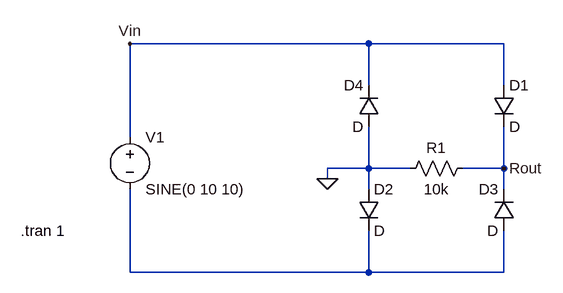
[diagram p0: schematic Bridge Rectifier.asc]
Bridge Rectifier.asc, the LTspice schematic file:
Version 4
SHEET 1 896 680
WIRE 400 -16 32 -16
WIRE 608 -16 400 -16
WIRE 400 48 400 -16
WIRE 608 48 608 -16
WIRE 32 128 32 -16
WIRE 400 176 400 112
WIRE 400 176 336 176
WIRE 464 176 400 176
WIRE 608 176 608 112
WIRE 608 176 544 176
WIRE 336 192 336 176
WIRE 400 208 400 176
WIRE 608 208 608 176
WIRE 32 336 32 208
WIRE 400 336 400 272
WIRE 400 336 32 336
WIRE 608 336 608 272
WIRE 608 336 400 336
FLAG 32 -16 Vin
FLAG 608 176 Rout
FLAG 336 192 0
SYMBOL diode 592 48 R0
SYMATTR InstName D1
SYMBOL diode 384 208 R0
SYMATTR InstName D2
SYMBOL diode 624 272 R180
WINDOW 0 24 64 Left 2
WINDOW 3 24 0 Left 2
SYMATTR InstName D3
SYMBOL diode 416 112 R180
WINDOW 0 24 64 Left 2
WINDOW 3 24 0 Left 2
SYMATTR InstName D4
SYMBOL res 560 160 R90
WINDOW 0 0 56 VBottom 2
WINDOW 3 32 56 VTop 2
SYMATTR InstName R1
SYMATTR Value 10k
SYMBOL voltage 32 112 R0
WINDOW 123 0 0 Left 0
WINDOW 39 0 0 Left 0
SYMATTR InstName V1
SYMATTR Value SINE(0 10 10)
TEXT -136 272 Left 2 !.tran 1

The netlist it stands for:
* Bridge Rectifier.asc
D1 Vin Rout D
D2 0 N001 D
D3 N001 Rout D
D4 0 Vin D
R1 Rout 0 10k
V1 Vin N001 SINE(0 10 10)
.model D D
.lib standard.dio
.tran 1
.backanno
.end

* Results of the author's LTspice run, read from the files saved beside the schematic
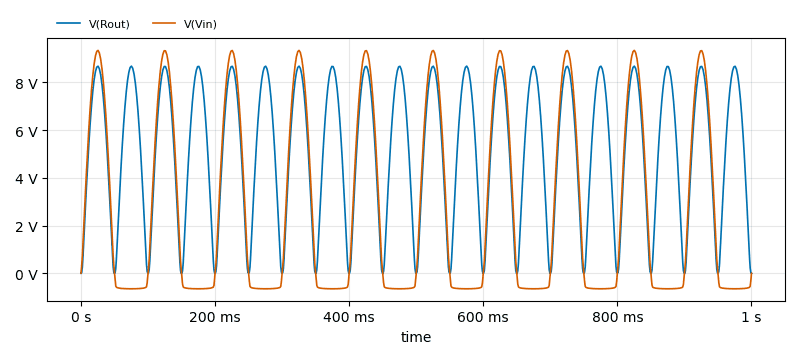
[diagram p1: Transient Analysis of Bridge Rectifier.asc, plotted from the saved traces]
* Transient Analysis, 1 run:
*   V(Rout): min 0 V, max 8.686 V, average 5.144 V, rms 5.927 V, last 0 V
*   V(Vin): min -651.5 mV, max 9.347 V, average 2.572 V, rms 4.614 V, last 0 V